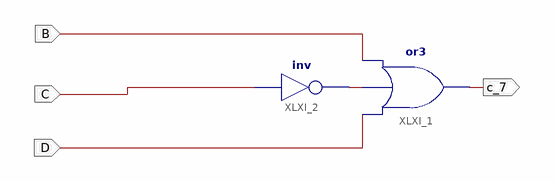
[diagram p0: schematic sheet 1]
// Xilinx ISE schematic c_7.sch (spartan6) as structural Verilog: 2 symbols, 4 ports
module c_7 (
  input  B,
  input  C,
  input  D,
  output c_7
);

  wire XLXN_7;

  or XLXI_1 (c_7, D, XLXN_7, B);
  not XLXI_2 (XLXN_7, C);
endmodule
